# EAGLE schematic garageDoor (EAGLE 6.5.0)
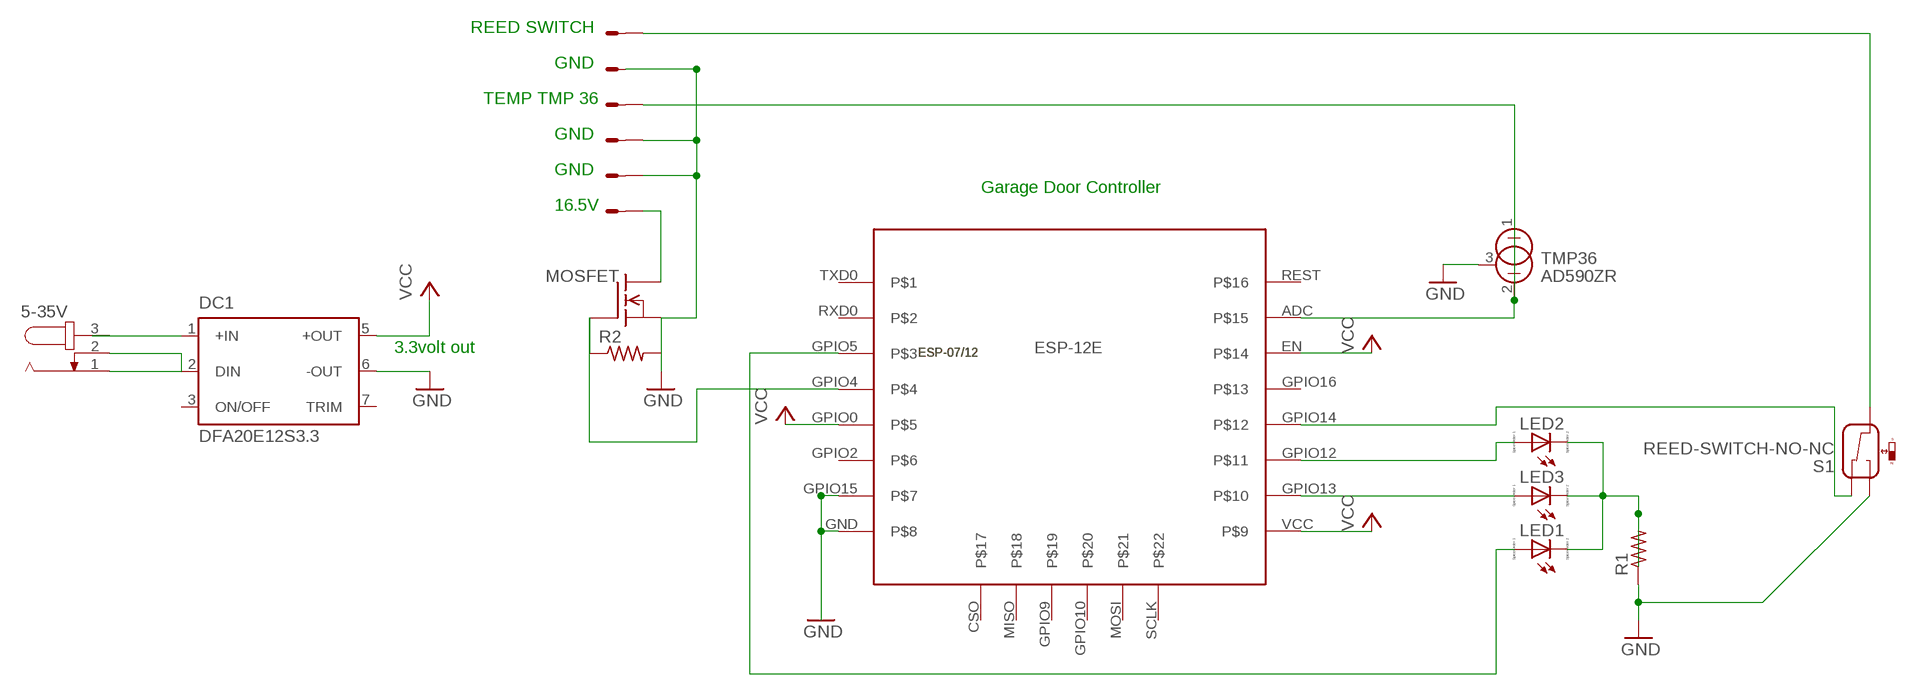
[diagram p0: schematic, sheet 1]

## Parts
5-35V  JACK-PLUG1  [SPC4078]
DC1  DFA20E12S3.3  [DFA20]
LED1  LED_ELD260  [LED_LD260]
LED2  LED_ELD260  [LED_LD260]
LED3  LED_ELD260  [LED_LD260]
MOSFET  BUZ10  [TO220]
R1  R-US_0204/2V  [0204V]
R2  R-US_0204/2V  [0204V]
S1  REED-SWITCH-NO-NC  [MK6-8-C]
SV1  16.5  MT6-6Y  [MT6-6Y]
SV2  16.5  MT6-6Y  [MT6-6Y]
TMP36  AD590ZR  [TO92]
U$1  ESP-07/12_ESP-12E  [ESP-07/12]

## Nets
GND: MOSFET.3(S) R1.1 S1.NO SV1.4 SV1.5 TMP36.3(CAN)
N$1: LED3.A U$1.GPIO13
N$2: LED2.A U$1.GPIO12
N$3: S1.NC U$1.GPIO14
N$4: LED1.K(C) LED2.K(C) LED3.K(C) R1.2
N$5: U$1.GND U$1.GPIO15
N$6: MOSFET.2(D) SV1.6
N$7: LED1.A U$1.GPIO5
N$8: MOSFET.1(G) R2.1 U$1.GPIO4
N$9: SV1.3 TMP36.1(+) TMP36.2(-) U$1.ADC
N$10: S1.COM SV2.1
N$11: DC1.1(+IN)
N$12: 5-35V.1 5-35V.2 DC1.2(DIN)
VCC: DC1.5(+OUT) U$1.EN U$1.GPIO0 U$1.VCC
Unconnected: 5-35V.3 DC1.3(ON/OFF) DC1.6(-OUT) DC1.7(TRIM) R2.2 SV1.1 SV1.2 SV2.2 SV2.3 SV2.4 SV2.5 SV2.6 U$1.CSO U$1.GPIO2 U$1.GPIO9 U$1.GPIO10 U$1.GPIO16 U$1.MISO U$1.MOSI U$1.REST U$1.RXD0 U$1.SCLK U$1.TXD0

## Notes on the sheet
- REED SWITCH
- GND
- TEMP TMP 36
- GND
- GND
- Garage Door Controller
- 16.5V
- 3.3volt out

## Library data of the parts
5-35V = con-jack:JACK-PLUG: DC POWER JACK Power Jack, DC, Right Angle, Through Hole, Rated 5A at 16VDC, PC Terminals Distributor: Farnell (www.Farnell.de) Drawing: 84N1161.pdf / 84N1162.pdf Manufacturer: SPC Technology (www.spctechnology.com) Type: SPC4077 / SPC 4078; OC_FARNELL: unknown; OC_NEWARK: unknown
DC1 = dc-dc-converter:DFA20E: DFA20 Single-Output DC-DC Series Source: www.power-one.com / dfa20s_PCB mountable.pdf; OC_FARNELL: unknown; OC_NEWARK: unknown
LED1-LED3 = eagle-ltspice:LED_E: LED Source: http://www.osram.convergy.de Source: www.luxeon.com Source: www.kingbright.com; SPICEMODEL: NONE; SPICEPREFIX: D; SPICETYPE: diode
MOSFET = transistor-fet:BUZ10: N-Channel Enhancement MOSFET 50V; 20A; 0,080Ohm
R1 R2 = resistor:R-US_: RESISTOR, American symbol
S1 = switch-reed:REED-SWITCH-NO-NC: Reed Sensor NO NC
SV1 SV2 = con-amp-mt:MT6-6Y: AMP MT6 CONNECTOR; OC_FARNELL: unknown; OC_NEWARK: unknown
TMP36 = linear:AD590ZR: TEMPERATURE SENSOR current output
U$1 = ESP-12E:ESP-07/12: Version 1.0 of the library for the ESP-07/12 full GPIO dev board module byME Jon jonnyradu@gmail.com